# Altium schematic sheet RC_Inverter.SchDoc
size A4
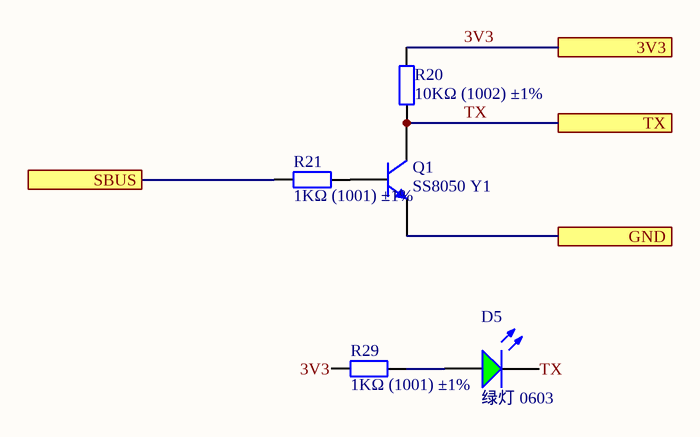
[diagram p0: RC_Inverter.SchDoc]

## Parts
D5  绿灯 0603  [0603_LED_S1]
Q1  SS8050 Y1  [SOT-23(SOT-23-3)]
R20  10KΩ (1002) ±1%  [0402_R]
R21  1KΩ (1001) ±1%  [0402_R]
R29  1KΩ (1001) ±1%  [0402_R]

## Ports
3V3, GND, SBUS, TX

## Nets
3V3: R20.2 R29.1 ; port 3V3
GND: Q1.2(E) ; port GND
SBUS: R21.1 ; port SBUS
TX: D5.K Q1.3(C) R20.1 ; port TX
NetD5_A: D5.A R29.2
NetQ1_1: Q1.1(B) R21.2

## Library data of the parts
D5 = 0603 绿灯: 发光二极管; ComponentLink1Description: 供应商链接; ComponentLink1URL: http://www.szlcsc.com/product/details_73152.html; Package: 0603; Supplier: LC; SuppliersPartNumber: C72043
Q1 = SOT-23 SS8050 Y1: 三极管; ComponentLink1Description: 供应商链接; ComponentLink1URL: http://www.szlcsc.com/product/details_2507.html; Package: SOT-23; Supplier: LC; SuppliersPartNumber: C2150
R20 = 0402 10KΩ (1002) 1%: 贴片电阻; ComponentLink1Description: 供应商链接; ComponentLink1URL: http://www.szlcsc.com/product/details_26487.html; Package: 0402; Supplier: LC; SuppliersPartNumber: C25744
R21 R29 = 0402 1KΩ (1001) 1%: 贴片电阻; ComponentLink1Description: 供应商链接; ComponentLink1URL: http://www.szlcsc.com/product/details_12256.html; Package: 0402; Supplier: LC; SuppliersPartNumber: C11702